# EAGLE design LB_BIT_i17_timeout-v03(rev1) (EAGLE 6.6.0)
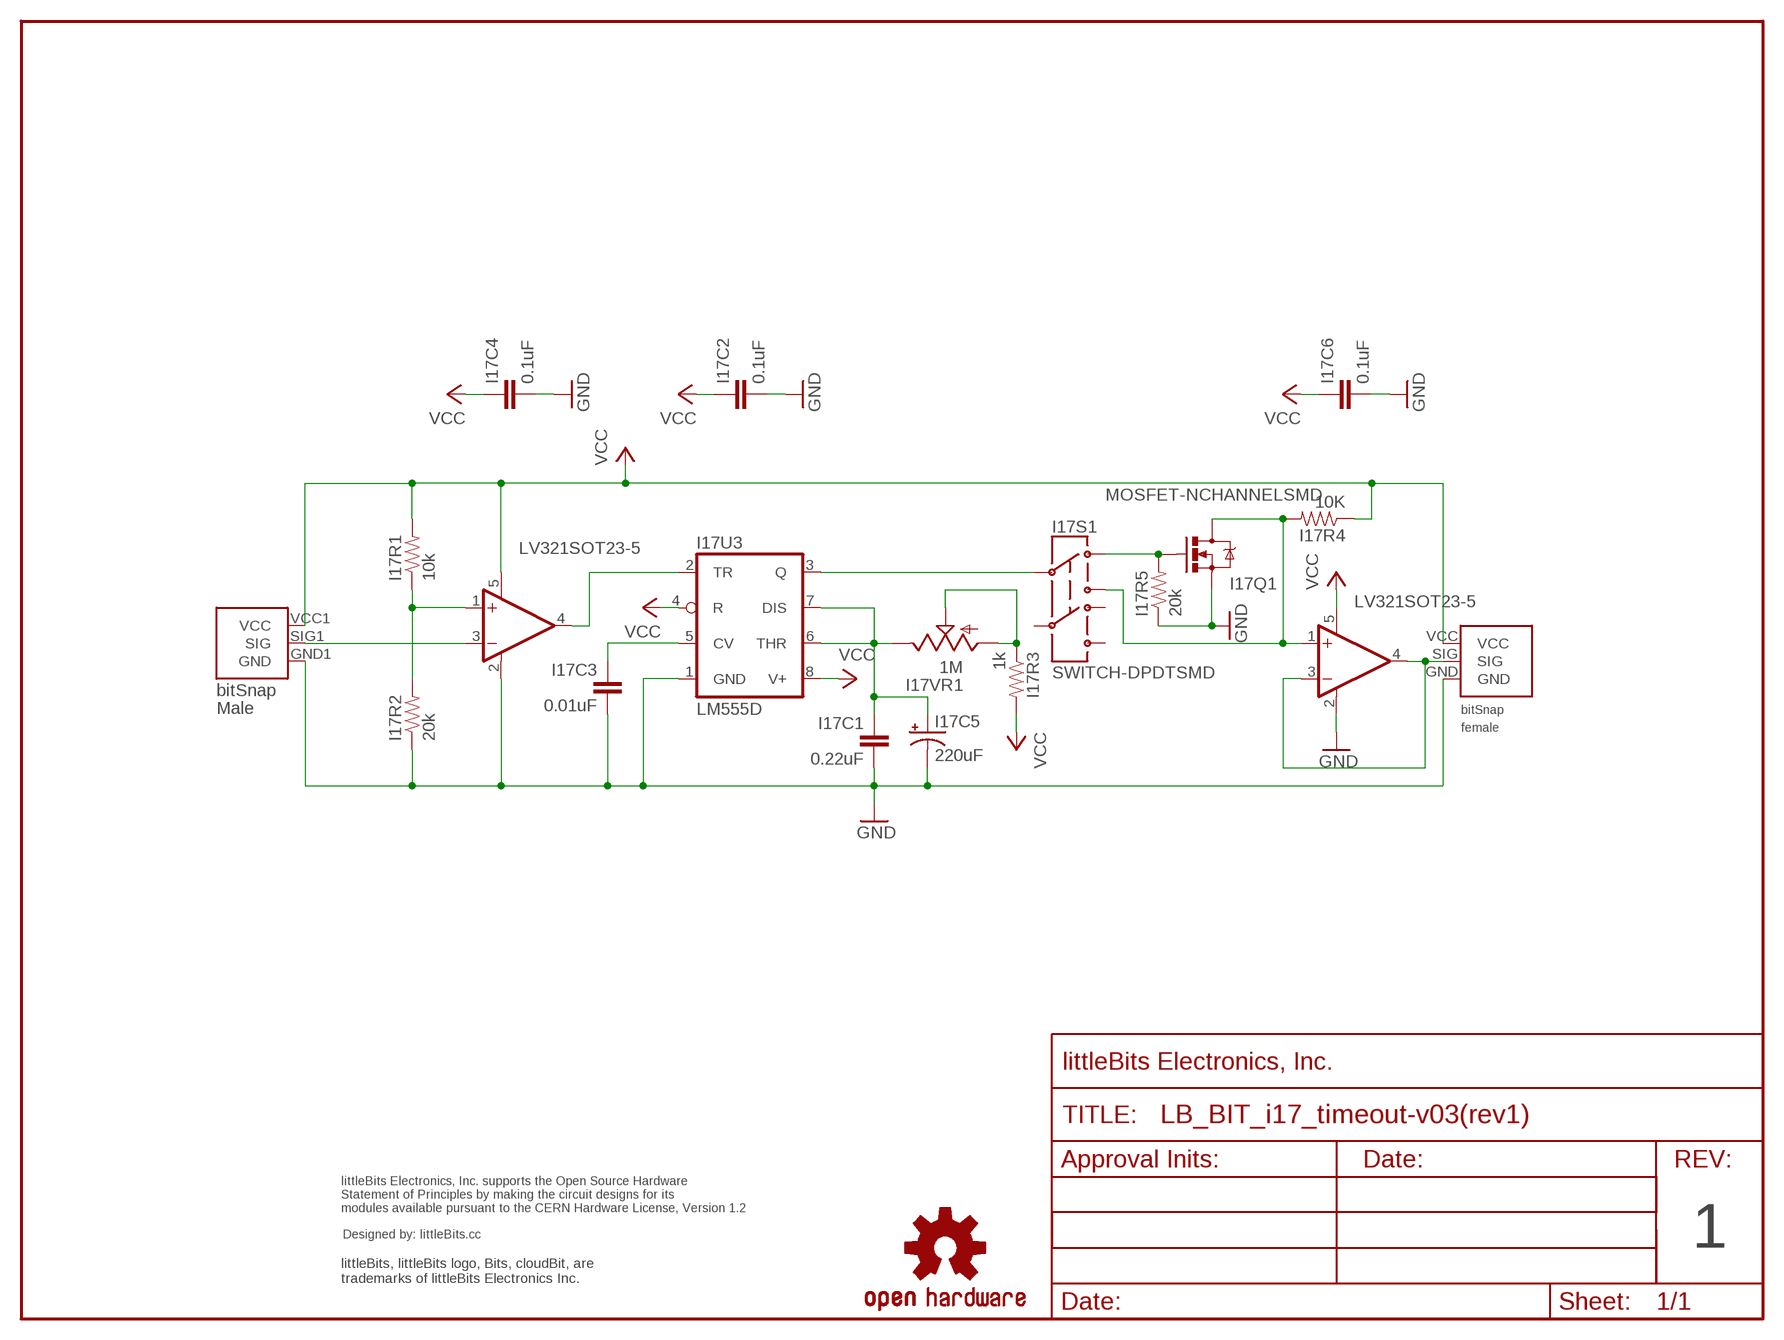
[diagram p0: schematic, sheet 1]

## Parts
I17BSF1  BITSNAP_V03_FEMALE  [BITSNAP_V03_FEMALE]
I17BSM1  BITSNAP_V03_MALE  [BITSNAP_V03_MALE]
I17C1  0.22uF  CAP0603-CAP  [0603-CAP]
I17C2  0.1uF  CAP0603-CAP  [0603-CAP]
I17C3  0.01uF  CAP0603-CAP  [0603-CAP]
I17C4  0.1uF  CAP0603-CAP  [0603-CAP]
I17C5  220uF  CAP_POLD  [PANASONIC_D]
I17C6  0.1uF  CAP0603-CAP  [0603-CAP]
I17Q1  MOSFET-NCHANNELSMD  [SOT23-3]
I17R1  10k  RESISTOR0603-RES  [0603-RES]
I17R2  20k  RESISTOR0603-RES  [0603-RES]
I17R3  1k  RESISTOR0603-RES  [0603-RES]
I17R4  10K  RESISTOR0603-RES  [0603-RES]
I17R5  20k  RESISTOR0603-RES  [0603-RES]
I17S1  SWITCH-DPDTSMD  [AYZ0202]
I17U1  LV321SOT23-5  [SOT23-5]
I17U2  LV321SOT23-5  [SOT23-5]
I17U3  LM555D  [SO08]
I17VR1  1M  POT-TRIM-SMD-BOURNS-3303  [POT-TRIM-SMD-BOURNS-3303]
U$1  OSHWCREDIT  [OSHWCREDIT]
U$2  FRAME-LETTER-OHWOHW  [FABDWG01-OHW]
U$4  OSHW-LOGOL  [OSHW-LOGO-L]

## Nets
GND: I17BSF1.GND I17BSM1.GND1(GND) I17C1.2 I17C2.2 I17C3.2 I17C4.2 I17C5.- I17C6.2 I17Q1.2(S) I17R2.1 I17R5.1 I17U1.2(V-) I17U2.2(V-) I17U3.1(GND)
N$1: I17C3.1 I17U3.5(CV)
N$2: I17Q1.3(D) I17R4.2 I17S1.3 I17U2.1(+IN)
N$3: I17Q1.1(G) I17R5.2 I17S1.1
N$4: I17BSM1.SIG1(SIG) I17U1.3(-IN)
N$5: I17R3.1 I17VR1.1(A) I17VR1.2(S)
N$6: I17S1.2 I17U3.3(Q)
N$7: I17BSF1.SIG I17U2.3(-IN) I17U2.4(OUT)
N$8: I17U1.4(OUT) I17U3.2(TR)
N$10: I17R1.1 I17R2.2 I17U1.1(+IN)
N$11: I17C1.1 I17C5.+ I17U3.6(THR) I17U3.7(DIS) I17VR1.3(E)
VCC: I17BSF1.VCC I17BSM1.VCC1(VCC) I17C2.1 I17C4.1 I17C6.1 I17R1.2 I17R3.2 I17R4.1 I17U1.5(V+) I17U2.5(V+) I17U3.4(R) I17U3.8(V+)
Unconnected: I17S1.4 I17S1.5 I17S1.6

## Notes on the sheet
- 1

## Library data of the parts
I17BSF1 = bitSnap:BITSNAP_V03_FEMALE
I17BSM1 = bitSnap:BITSNAP_V03_MALE
I17C1-I17C4 I17C6 = SparkFun:CAP: Capacitor Standard 0603 ceramic capacitor, and 0.1" leaded capacitor.
I17C5 = SparkFun:CAP_POL: Capacitor Polarized These are standard SMD and PTH capacitors. Normally 10uF, 47uF, and 100uF in electrolytic and tantalum varieties. Always verify the external diameter of the through hole cap, it varies with capacity, voltage, and manufacturer. The EIA devices should be standard.
I17Q1 = SparkFun:MOSFET-NCHANNEL
I17R1-I17R5 = SparkFun:RESISTOR: Resistor Basic schematic elements and footprints for 0603, 1206, and PTH 1/10th watt (small) resistors.
I17S1 = SparkFun:SWITCH-DPDT: DPDT Version of the COM-00597
I17U1 I17U2 = LITTLEBITS:LV321
I17U3 = linear:*555: TIMER
I17VR1 = LITTLEBITS:POT-TRIM-SMD-BOURNS-3303
U$1 = LITTLEBITS:OSHWCREDIT
U$2 = LITTLEBITS:FRAME-LETTER-OHW
U$4 = SparkFun_NEW:OSHW-LOGO: Open Source Hardware Logo This logo indicates the piece of hardware it is found on incorporates a OSHW license and/or adheres to the definition of open source hardware found here: http://freedomdefined.org/OSHW

## Board
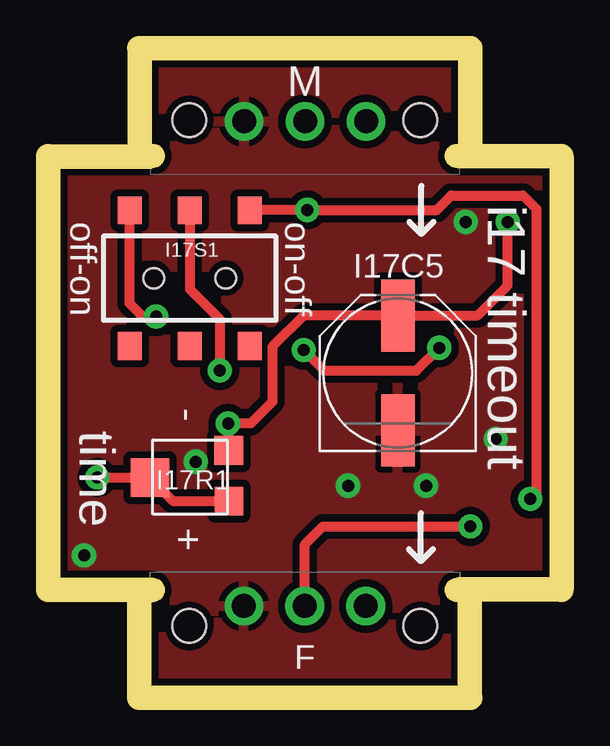
[diagram p1: board, top side]
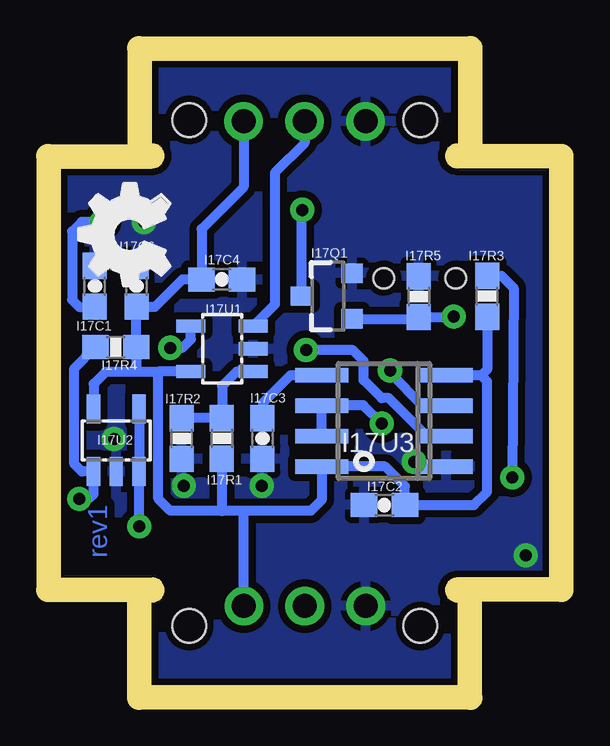
[diagram p2: board, bottom side, seen from below]

Size 20.4 x 26.1 mm. Coordinates in mm from the lower left corner, seen from the top.
Outline: 0,4.5 0,21.6
Outline: 20.4,21.6 20.4,4.5
Copper layers (1*16): Top 0.035mm / dielectric 1.5mm / Bottom 0.035mm
Design rules "default": minimum track width 8mil, minimum drill 20mil, track to track 8mil, track to pad 8mil, pad to pad 8mil, via to via 8mil, smd to smd 8mil, copper to edge 10mil, drill to drill 8mil, minimum pad ring 12mil, minimum via ring 10mil, stop-mask expansion 4mil, vias tented up to drill 25mil, thermal gap 10mil
Milling: 2 lines

### Footprints (pad centres in the part's own frame; a part is rotated, then mirrored left to right if it is on the bottom)
BITSNAP_V03_FEMALE = drill 1: GND 3.91,3.33; SIG 6.45,3.33; VCC 8.99,3.33 | hole 1.4: 1.63,2.5; 11.27,2.5
BITSNAP_V03_MALE = drill 1: GND1 8.98,2.56; SIG1 6.44,2.56; VCC1 3.9,2.56 | hole 1.4: 11.27,2.5; 1.63,2.5
0603-CAP = smd 1.1 x 1: 1 -0.85,0; 2 0.85,0
PANASONIC_D = smd 3 x 1.4: + 2.4,0; - -2.4,0
SOT23-3 = smd 0.8 x 0.9: 1 -0.95,-1; 2 0.95,-1; 3 0,1.1
0603-RES = smd 1.1 x 1: 1 -0.85,0; 2 0.85,0
AYZ0202 = smd 1 x 1.15: 1 -2.5,2.825; 2 0,2.825; 3 2.5,2.825; 4 -2.5,-2.825; 5 0,-2.825; 6 2.5,-2.825 | hole 0.85: 1.5,0; -1.5,0
SOT23-5 = smd 0.55 x 1.2: 1 -0.95,-1.3; 2 0,-1.3; 3 0.95,-1.3; 4 0.95,1.3; 5 -0.95,1.3
SO08 = smd 0.6 x 2.2: 1 -1.905,-2.6; 2 -0.635,-2.6; 3 0.635,-2.6; 4 1.905,-2.6; 5 1.905,2.6; 6 0.635,2.6; 7 -0.635,2.6; 8 -1.905,2.6
POT-TRIM-SMD-BOURNS-3303 = smd 1.2 x 1.2: 1 0.543,-3.172; 3 2.66,-3.168 | smd 1.6 x 1.6: 2 1.52,0.115

### Placement (x,y rotation side)
I17BSF1  3.75,0 0 top
I17BSM1  16.65,26.1 180 top
I17C1  18.95,16.67 90 bottom
I17C2  6.88,7.54 180 bottom
I17C3  11.97,10.32 270 bottom
I17C4  13.66,16.95 0 bottom
I17C5  14.08,13.05 90 top
I17C6  17.21,16.67 90 bottom
I17Q1  9.23,16.26 90 bottom
I17R1  13.65,10.32 270 bottom
I17R2  15.33,10.31 90 bottom
I17R3  2.61,16.25 270 bottom
I17R4  18.07,14.12 180 bottom
I17R5  5.45,16.23 270 bottom
I17S1  5.41,17 0 top
I17U1  13.65,14.06 90 bottom
I17U2  18.06,10.24 0 bottom
I17U3  6.9,11.05 90 bottom
I17VR1  3.87,7.16 90 top
U$1  -112.79,-61.5 0 top  (outside the outline)
U$2  -18.64,0.65 0 top  (outside the outline)
U$4  -53.6,-65.92 0 top  (outside the outline)
U$6  [OSHW_FILLX150_NOTEXT]  15.82,15.86 0 top

### Tracks (layer width: path | path; a pad name or v marks a point on that pad's centre or on a via)
GND  (via drill 0.5)
  Bottom 0.406: I17U3.1 5.44,9.14 v5.65,9.35
  other vias: 12,8.35 15.25,8.35 18.15,10.3 1,5.45 16.9,19.35
  pour Bottom (isolate 0.305): 0.22,25.85 20.17,25.85 20.17,0.22 0.22,0.22
  pour Top (isolate 0.305): 0.22,25.85 20.19,25.85 20.19,0.22 0.22,0.22
N$1
  Bottom 0.406: I17U3.5 10.8,12.95 11.95,11.8 11.95,11.19 I17C3.1
N$2  (via drill 0.5)
  Top 0.406: I17S1.3 7.94,19.85 v10.3,19.85 15.7,19.85 16.3,20.45 19.3,20.45 19.85,19.9 19.85,8 v19.6,7.8
  Bottom 0.406: I17R4.2 19.8,13.25 19.8,9.25 19.49,8.94 I17U2.1 19,8 19.25,7.8 v19.6,7.8 | I17Q1.3 10.33,19.78 v10.3,19.85 10.33,19.82 I17Q1.3
N$3  (via drill 0.5)
  Top 0.406: v4,15.4 3.45,15.4 2.9,15.95 I17S1.1
  Bottom 0.406: I17Q1.1 5.78,15.31 I17R5.2 4.02,15.38 v4,15.4
N$4
  Bottom 0.406: I17BSM1.SIG1 10.21,22.64 11.45,21.4 11.45,15.9 I17U1.3
N$5  (via drill 0.5)
  Top 0.406: I17VR1.1 4.73,7.7 I17VR1.2 3.73,8.7 v1.55,8.7
  Bottom 0.406: I17R3.1 2,17.1 1.5,16.6 v1.55,8.7
N$6  (via drill 0.5)
  Top 0.406: I17S1.2 5.41,16.54 6.65,15.3 v6.65,13.15
  Bottom 0.406: v6.65,13.15 6.65,13.05 5.3,11.7 4.31,11.7 I17U3.3
N$7  (via drill 0.5)
  Top 0.406: I17BSF1.SIG 10.2,5.9 10.95,6.65 v17.1,6.65
  Bottom 0.406: I17U2.4 I17U2.3 v17.1,6.65
N$8  (via drill 0.5)
  Top 0.406: v10.15,14 11,13.15 14.85,13.15 v15.8,14.1
  Bottom 0.406: I17U3.2 5.11,10.41 6.7,12 7,12 7.75,12.75 7.75,13.55 8.2,14 v10.15,14 | v15.8,14.1 15.3,14.1 14.95,14.45 I17U1.4
N$10
  Bottom 0.406: I17R2.2 I17R1.1 13.65,12.5 13.05,13.11 I17U1.1
N$11  (via drill 0.5)
  Top 0.406: I17VR1.3 7.03,10.88 v7,10.95 7.95,10.95 8.85,11.85 8.85,14.15 10.15,15.45 I17C5.+ 17.4,15.45 18.65,16.7 v18.65,19.35
  Bottom 0.406: I17U3.7 I17U3.6 7.76,11.7 v7,10.95 | v18.65,19.35 19.5,19.35 19.9,18.95 19.9,16.1 19.6,15.8 18.97,15.8 I17C1.1
VCC
  Bottom 0.406: I17R4.1 17.22,13.13 17.25,13.1 17.7,13.1 | I17U2.5 19,12.6 18.5,13.1 17.7,13.1 | 17.2,14.1 I17R4.1 | 2.85,12.95 2.6,12.7 2.6,8.1 3.16,7.54 I17C2.1 6.03,8.33 6.85,9.15 I17U3.8 9.5,7.75 9.95,7.3 12.7,7.3 | 2.85,12.95 I17U3.4 | 12.7,7.3 13.65,7.3 I17R1.2 13.65,7.3 14.05,7.3 15.8,7.3 16.3,7.8 16.3,13.11 | I17BSF1.VCC 12.74,7.26 12.7,7.3 | I17BSM1.VCC1 12.75,20.8 14.5,19.05 14.5,16.96 I17C4.1 15.3,16.95 16.45,15.8 17.19,15.8 I17C6.1 17.22,15.81 I17R4.1 | I17R3.2 2.61,13.19 2.85,12.95 | I17U1.5 16.3,13.11 | 17.7,13.1 17.7,13.11 16.3,13.11

### Text on the board
Bottom: rev1
tPlace: i17 timeout | off-on | on-off | - | time | +
tNames: I17R1
Milling: 1mm DIA. ROUTER PATH
dxf: 1 | i17 TIMEOUT PULSE DELAY BIT PCB | LB-BIT-i17-TIMEOUT-v03-GERBER-rev1 (8-31-2012)